# EasyEDA schematic schematic.json
TITLE: Portoise USB HUB V2; REV: 2.0; Date: 2024-07-24; Sheet: 1/1; Drawn By: Gabi; Company: Mission Mechatronics
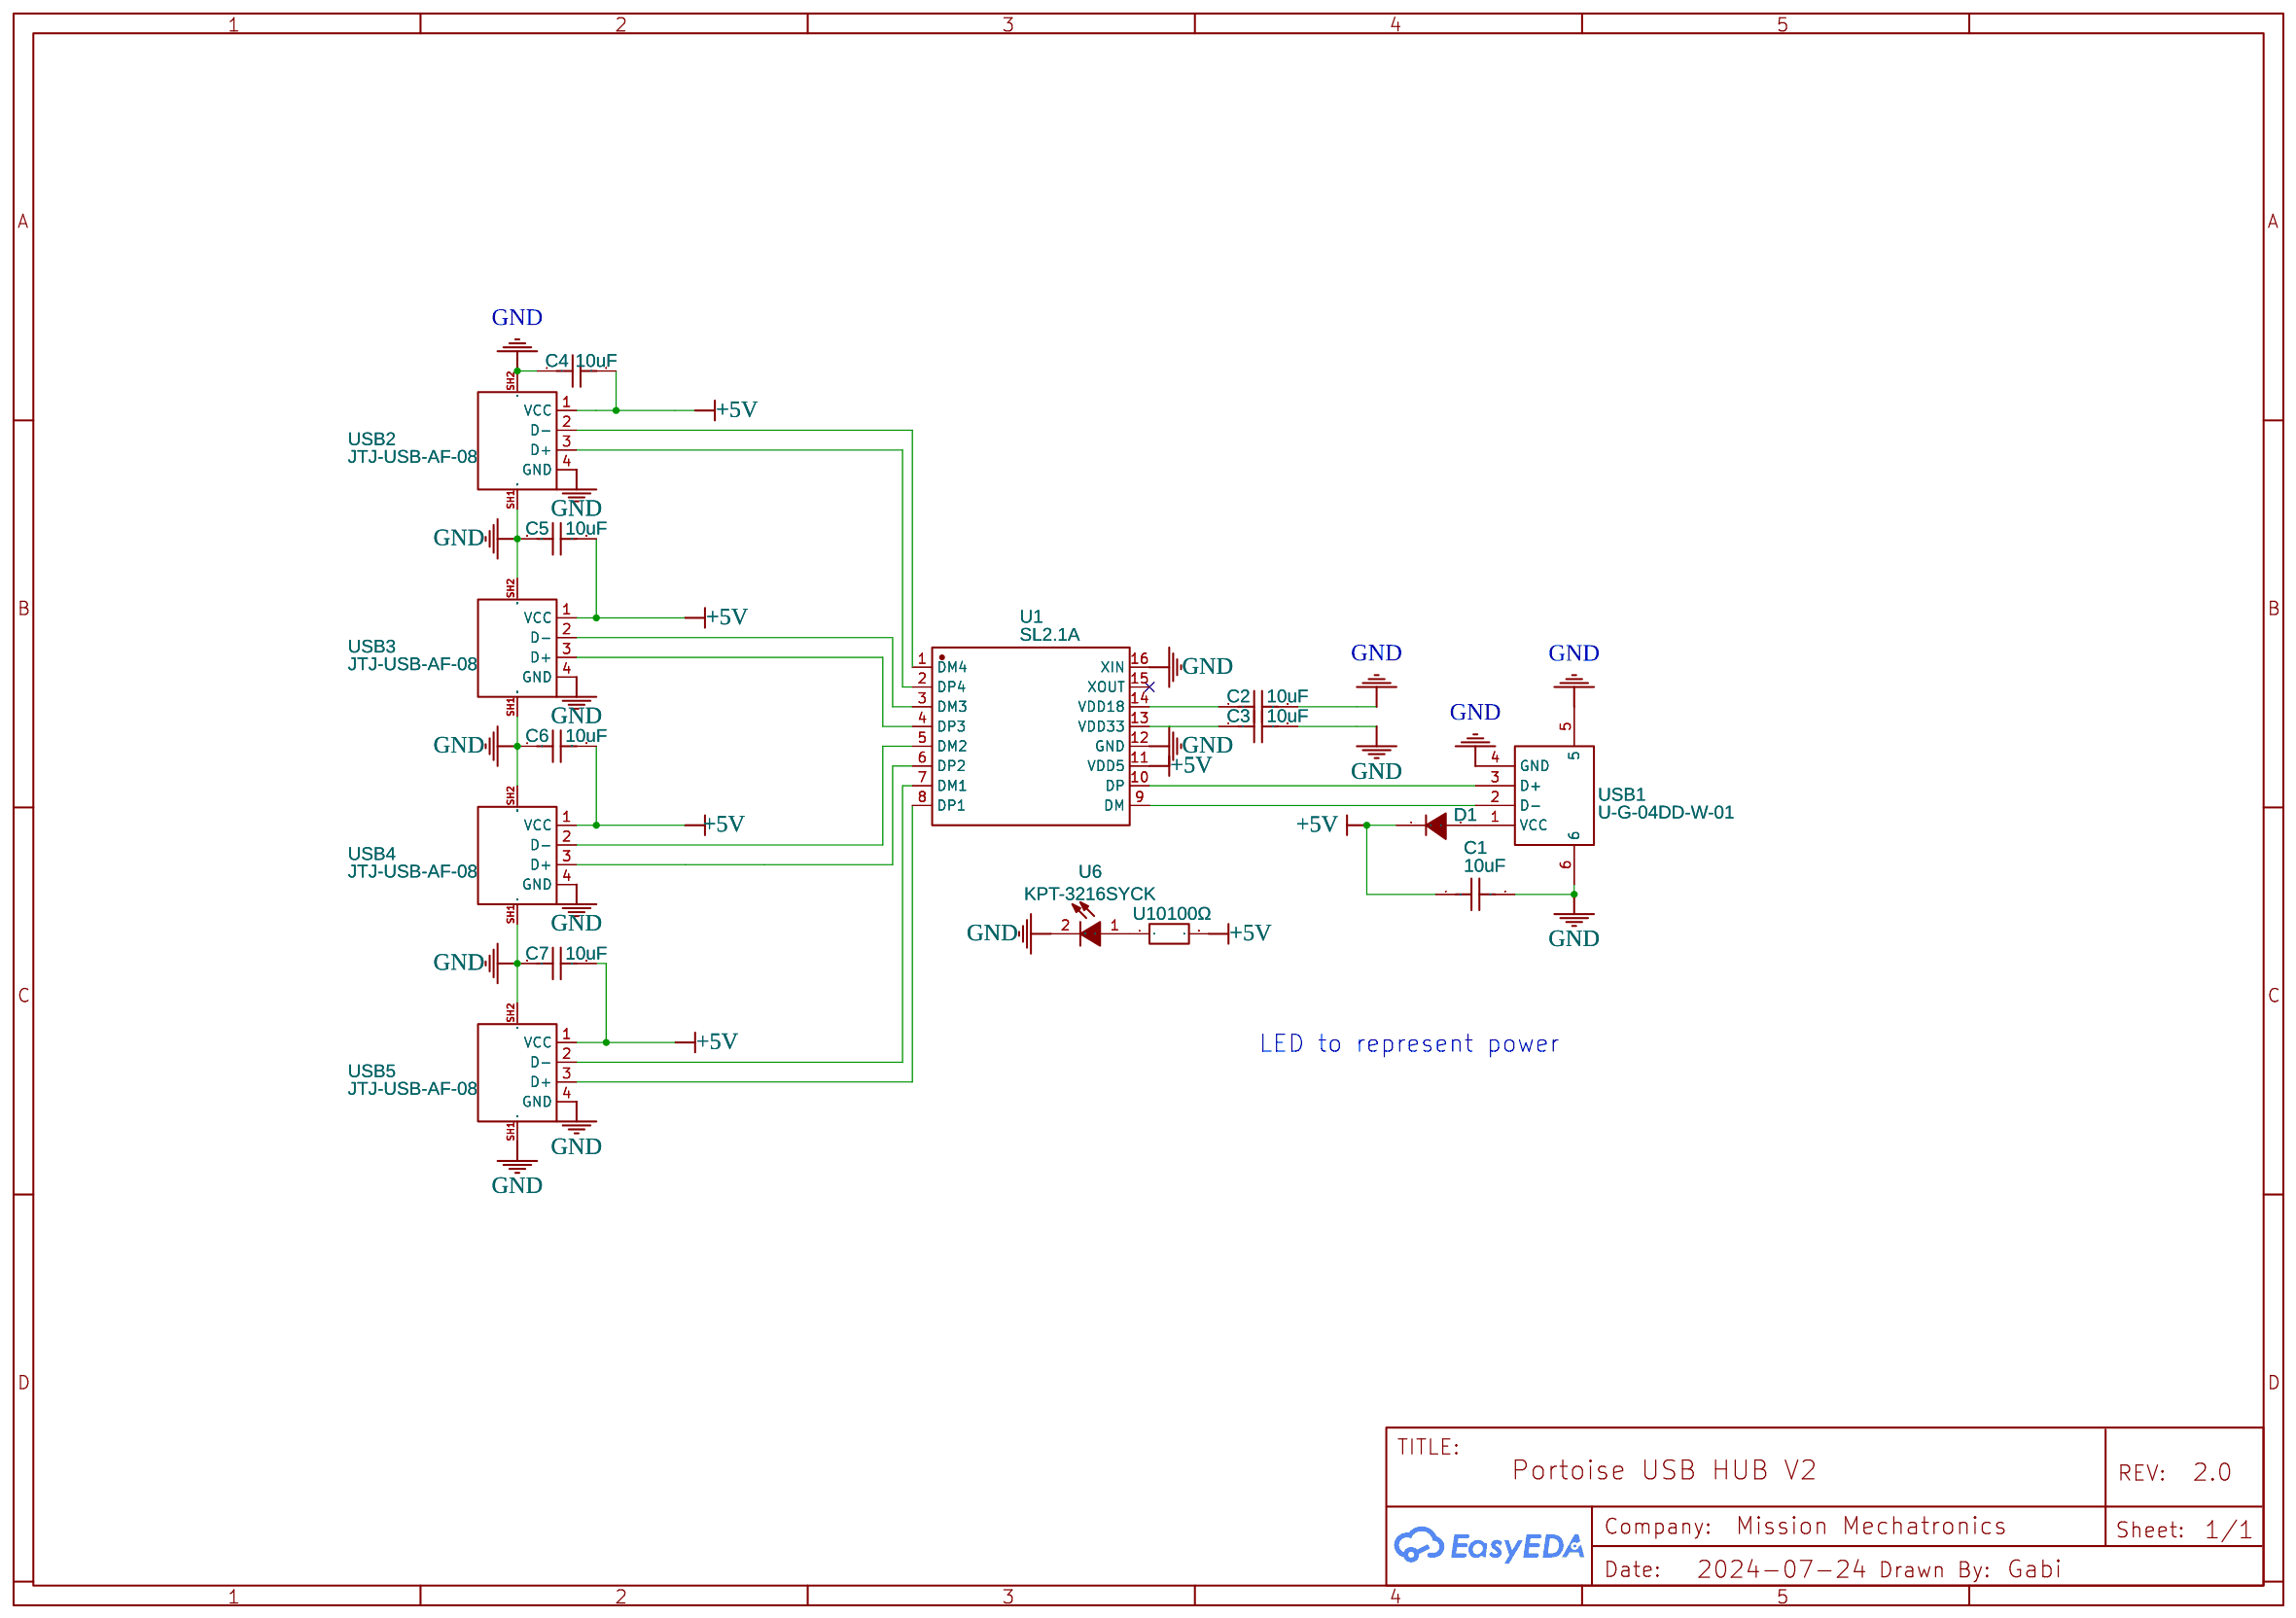
[diagram p0: schematic sheet]

## Parts
C1  10uF  [C0603]
C2  10uF  [C0603]
C3  10uF  [C0603]
C4  10uF  [C0603]
C5  10uF  [C0603]
C6  10uF  [C0603]
C7  10uF  [C0603]
D1  NSR0320MW2T1G  [SOD-323_L1.8-W1.3-LS2.5-RD]
U1  SL2.1A  [SOP-16_L10.0-W3.9-P1.27-LS6.0-BL]
U6  KPT-3216SYCK  [LED-SMD_L3.2-W1.6-R-RD]
U10  100Ω  [RES-TH_BD5.5-L16.5-P20.50-D0.8]
USB1  U-G-04DD-W-01  [USB-A-TH_U-G-04WD-W-01]
USB2  JTJ-USB-AF-08  [USB-A-TH__USB-AF-90]
USB3  JTJ-USB-AF-08  [USB-A-TH__USB-AF-90]
USB4  JTJ-USB-AF-08  [USB-A-TH__USB-AF-90]
USB5  JTJ-USB-AF-08  [USB-A-TH__USB-AF-90]

## Library data of the parts
C1-C7 = CL10A106KP8NNNC: Supplier: LCSC; Manufacturer: SAMSUNG(三星); Supplier Part: C19702; JLCPCB Part Class: Basic Part
D1 = NSR0320MW2T1G: Supplier: LCSC; Manufacturer: onsemi(安森美); Supplier Part: C48192; JLCPCB Part Class: Extended Part
U1 = SL2.1A: Contributor: LCSC; Supplier: LCSC; Supplier Part: C192893; Manufacturer: CoreChips(和芯润德); JLCPCB Part Class: Extended Part
U6 = KPT-3216SYCK: Contributor: LCSC; Supplier: LCSC; Supplier Part: C598374; Manufacturer: Kingbright; JLCPCB Part Class: Extended Part
U10 = OX101KE: Contributor: LCSC; Supplier: LCSC; Supplier Part: C2641644; Manufacturer: Ohmite; JLCPCB Part Class: Extended Part
USB1 = U-G-04DD-W-01: Supplier: LCSC; Manufacturer: 韩国韩荣; Manufacturer Part: U-G-O4DD-W-1; Supplier Part: C98125; JLCPCB Part Class: Extended Part
USB2-USB5 = JTJ-USB-AF-08: Contributor: LCSC; Supplier: LCSC; Manufacturer Part: 902-131A1011D10100; Supplier Part: C2345; JLCPCB Part Class: Extended Part; Manufacturer: 精拓金

## Nets
+5V: C1.1 C4.2 C5.2 C6.2 C7.2 D1.1(C) U1.11(VDD5) U10.2 USB2.1(VCC) USB3.1(VCC) USB4.1(VCC) USB5.1(VCC)
GND: C1.2 C2.2 C3.2 C4.1 C5.1 C6.1 C7.1 U1.12(GND) U1.16(XIN) U6.2(C) USB1.4(GND) USB1.5 USB1.6 USB2.4(GND) USB2.SH1 USB2.SH2 USB3.4(GND) USB3.SH1 USB3.SH2 USB4.4(GND) USB4.SH1 USB4.SH2 USB5.4(GND) USB5.SH1 USB5.SH2
Net-(C2-1): C2.1 U1.14(VDD18)
Net-(C3-1): C3.1 U1.13(VDD33)
Net-(D1-2): D1.2(A) USB1.1(VCC)
Net-(U1-1): U1.1(DM4) USB2.2(D-)
Net-(U1-2): U1.2(DP4) USB2.3(D+)
Net-(U1-3): U1.3(DM3) USB3.2(D-)
Net-(U1-4): U1.4(DP3) USB3.3(D+)
Net-(U1-5): U1.5(DM2) USB4.2(D-)
Net-(U1-6): U1.6(DP2) USB4.3(D+)
Net-(U1-7): U1.7(DM1) USB5.2(D-)
Net-(U1-8): U1.8(DP1) USB5.3(D+)
Net-(U1-9): U1.9(DM) USB1.2(D-)
Net-(U1-10): U1.10(DP) USB1.3(D+)
Net-(U6-1): U6.1(A) U10.1

Not connected (* = marked no-connect by the designer): U1 15(XOUT)*

## Notes on the sheet
- LED to represent power
